# Altium schematic sheet Mesh.SchDoc
size A3; Organization: Altium Limited; Address1: L3, 12a Rodborough Rd; Address2: Frenchs Forest; Address3: NSW; Address4: Australia 2086
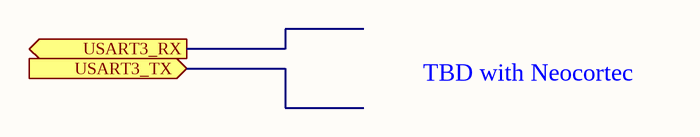
[diagram p0: Mesh.SchDoc]

## Ports
USART3_RX (out), USART3_TX (in)

## Notes on the sheet
- TBD with Neocortec
- Title
- Size:
- Date:
- A3
- Number:
- Time:
- Revision:
- Sheet
- of
- File: